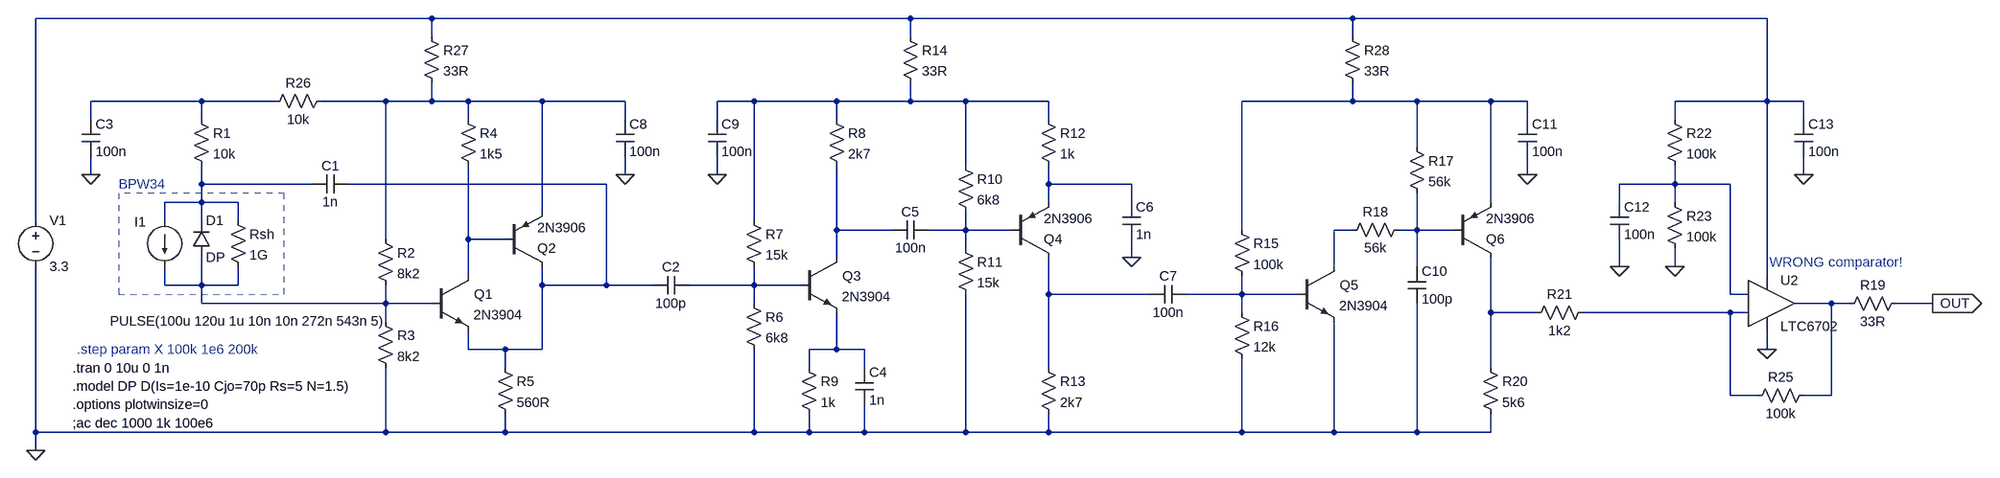
[diagram p0: schematic Lighthouse Sensor Alan Yates Twitter.asc]
Lighthouse Sensor Alan Yates Twitter.asc, the LTspice schematic file:
Version 4
SHEET 1 2772 700
WIRE 48 -112 -640 -112
WIRE 880 -112 48 -112
WIRE 1648 -112 880 -112
WIRE 2368 -112 1648 -112
WIRE 48 -80 48 -112
WIRE 880 -80 880 -112
WIRE 1648 -80 1648 -112
WIRE -352 32 -544 32
WIRE -224 32 -352 32
WIRE -32 32 -144 32
WIRE 48 32 48 0
WIRE 48 32 -32 32
WIRE 112 32 48 32
WIRE 240 32 112 32
WIRE 384 32 240 32
WIRE 608 32 544 32
WIRE 752 32 608 32
WIRE 880 32 880 0
WIRE 880 32 752 32
WIRE 976 32 880 32
WIRE 1120 32 976 32
WIRE 1648 32 1648 0
WIRE 1648 32 1456 32
WIRE 1760 32 1648 32
WIRE 1888 32 1760 32
WIRE 1952 32 1888 32
WIRE 2368 32 2368 -112
WIRE 2368 32 2208 32
WIRE 2432 32 2368 32
WIRE -544 64 -544 32
WIRE -352 64 -352 32
WIRE 112 64 112 32
WIRE 384 64 384 32
WIRE 544 64 544 32
WIRE 752 64 752 32
WIRE 1120 64 1120 32
WIRE 1952 64 1952 32
WIRE 2208 64 2208 32
WIRE 2432 64 2432 32
WIRE 1760 112 1760 32
WIRE 976 144 976 32
WIRE -544 160 -544 128
WIRE 384 160 384 128
WIRE 544 160 544 128
WIRE 1952 160 1952 128
WIRE 2432 160 2432 128
WIRE -352 176 -352 144
WIRE -160 176 -352 176
WIRE 352 176 -96 176
WIRE 1120 176 1120 144
WIRE 1264 176 1120 176
WIRE 2208 176 2208 144
WIRE 2208 176 2112 176
WIRE 2304 176 2208 176
WIRE -352 208 -352 176
WIRE -352 208 -416 208
WIRE -288 208 -352 208
WIRE 1120 208 1120 176
WIRE 1264 208 1264 176
WIRE 1888 208 1888 32
WIRE 2112 208 2112 176
WIRE 2208 208 2208 176
WIRE 240 224 240 32
WIRE -640 240 -640 -112
WIRE -416 240 -416 208
WIRE -352 240 -352 208
WIRE -288 240 -288 208
WIRE 608 240 608 32
WIRE 752 256 752 144
WIRE 848 256 752 256
WIRE 976 256 976 224
WIRE 976 256 912 256
WIRE 1056 256 976 256
WIRE 1456 256 1456 32
WIRE 1648 256 1616 256
WIRE 1760 256 1760 192
WIRE 1760 256 1728 256
WIRE 1824 256 1760 256
WIRE -32 272 -32 32
WIRE 112 272 112 144
WIRE 176 272 112 272
WIRE 976 288 976 256
WIRE 752 304 752 256
WIRE 1264 304 1264 272
WIRE 1616 320 1616 256
WIRE 1760 320 1760 256
WIRE 2112 320 2112 272
WIRE 2128 320 2112 320
WIRE 2208 320 2208 288
WIRE 112 336 112 272
WIRE 2368 336 2368 32
WIRE -416 352 -416 320
WIRE -352 352 -352 304
WIRE -352 352 -416 352
WIRE -288 352 -288 320
WIRE -288 352 -352 352
WIRE 240 352 240 320
WIRE 352 352 352 176
WIRE 352 352 240 352
WIRE 432 352 352 352
WIRE 608 352 608 320
WIRE 608 352 496 352
WIRE 688 352 608 352
WIRE 1120 368 1120 304
WIRE 1296 368 1120 368
WIRE 1456 368 1456 336
WIRE 1456 368 1360 368
WIRE 1552 368 1456 368
WIRE 2304 368 2304 176
WIRE 2336 368 2304 368
WIRE -352 384 -352 352
WIRE -32 384 -32 352
WIRE -32 384 -352 384
WIRE 48 384 -32 384
WIRE 608 384 608 352
WIRE 2480 384 2416 384
WIRE 2512 384 2480 384
WIRE 2656 384 2592 384
WIRE 1456 400 1456 368
WIRE 1888 400 1888 304
WIRE 1968 400 1888 400
WIRE 2304 400 2048 400
WIRE 2336 400 2304 400
WIRE -32 416 -32 384
WIRE 112 464 112 432
WIRE 176 464 112 464
WIRE 240 464 240 352
WIRE 240 464 176 464
WIRE 752 464 752 400
WIRE 752 464 704 464
WIRE 800 464 752 464
WIRE 2368 464 2368 432
WIRE 176 496 176 464
WIRE 704 496 704 464
WIRE 800 496 800 464
WIRE 1120 496 1120 368
WIRE 1888 496 1888 400
WIRE 2304 544 2304 400
WIRE 2352 544 2304 544
WIRE 2480 544 2480 384
WIRE 2480 544 2432 544
WIRE -640 608 -640 320
WIRE -32 608 -32 496
WIRE -32 608 -640 608
WIRE 176 608 176 576
WIRE 176 608 -32 608
WIRE 608 608 608 464
WIRE 608 608 176 608
WIRE 704 608 704 576
WIRE 704 608 608 608
WIRE 800 608 800 560
WIRE 800 608 704 608
WIRE 976 608 976 368
WIRE 976 608 800 608
WIRE 1120 608 1120 576
WIRE 1120 608 976 608
WIRE 1456 608 1456 480
WIRE 1456 608 1120 608
WIRE 1616 608 1616 416
WIRE 1616 608 1456 608
WIRE 1760 608 1760 384
WIRE 1760 608 1616 608
WIRE 1888 608 1888 576
WIRE 1888 608 1760 608
WIRE -640 640 -640 608
FLAG 2656 384 OUT
IOPIN 2656 384 Out
FLAG -544 160 0
FLAG -640 640 0
FLAG 384 160 0
FLAG 544 160 0
FLAG 1264 304 0
FLAG 1952 160 0
FLAG 2368 464 0
FLAG 2208 320 0
FLAG 2112 320 0
FLAG 2432 160 0
SYMBOL diode -368 304 M180
WINDOW 0 24 64 Left 2
WINDOW 3 24 0 Left 2
SYMATTR InstName D1
SYMATTR Value DP
SYMBOL current -416 240 R0
WINDOW 3 -95 175 Left 2
WINDOW 123 -52 30 Left 2
WINDOW 39 0 0 Left 2
WINDOW 0 -52 2 Left 2
SYMATTR Value PULSE(100u 120u 1u 10n 10n 272n 543n 5)
SYMATTR InstName I1
SYMBOL res -304 224 R0
SYMATTR InstName Rsh
SYMATTR Value 1G
SYMBOL voltage -640 224 R0
WINDOW 123 0 0 Left 2
WINDOW 39 0 0 Left 2
SYMATTR InstName V1
SYMATTR Value 3.3
SYMBOL res -368 48 R0
SYMATTR InstName R1
SYMATTR Value 10k
SYMBOL res -48 256 R0
SYMATTR InstName R2
SYMATTR Value 8k2
SYMBOL res -48 400 R0
SYMATTR InstName R3
SYMATTR Value 8k2
SYMBOL res 96 48 R0
SYMATTR InstName R4
SYMATTR Value 1k5
SYMBOL res 160 480 R0
SYMATTR InstName R5
SYMATTR Value 560R
SYMBOL npn 48 336 R0
WINDOW 0 74 32 Left 2
WINDOW 3 73 68 Left 2
SYMATTR InstName Q1
SYMATTR Value 2N3904
SYMBOL pnp 176 320 M180
SYMATTR InstName Q2
SYMATTR Value 2N3906
SYMBOL cap -96 160 R90
WINDOW 0 0 32 VBottom 2
WINDOW 3 32 32 VTop 2
SYMATTR InstName C1
SYMATTR Value 1n
SYMBOL cap 496 336 R90
WINDOW 0 0 32 VBottom 2
WINDOW 3 32 32 VTop 2
SYMATTR InstName C2
SYMATTR Value 100p
SYMBOL res 592 368 R0
SYMATTR InstName R6
SYMATTR Value 6k8
SYMBOL res 592 224 R0
SYMATTR InstName R7
SYMATTR Value 15k
SYMBOL cap -560 64 R0
SYMATTR InstName C3
SYMATTR Value 100n
SYMBOL npn 688 304 R0
WINDOW 0 74 32 Left 2
WINDOW 3 73 68 Left 2
SYMATTR InstName Q3
SYMATTR Value 2N3904
SYMBOL res 736 48 R0
SYMATTR InstName R8
SYMATTR Value 2k7
SYMBOL res 688 480 R0
SYMATTR InstName R9
SYMATTR Value 1k
SYMBOL cap 784 496 R0
SYMATTR InstName C4
SYMATTR Value 1n
SYMBOL cap 912 240 R90
WINDOW 0 0 32 VBottom 2
WINDOW 3 32 32 VTop 2
SYMATTR InstName C5
SYMATTR Value 100n
SYMBOL res 960 128 R0
SYMATTR InstName R10
SYMATTR Value 6k8
SYMBOL res 960 272 R0
SYMATTR InstName R11
SYMATTR Value 15k
SYMBOL pnp 1056 304 M180
SYMATTR InstName Q4
SYMATTR Value 2N3906
SYMBOL res 1104 48 R0
SYMATTR InstName R12
SYMATTR Value 1k
SYMBOL res 1104 480 R0
SYMATTR InstName R13
SYMATTR Value 2k7
SYMBOL cap 1248 208 R0
SYMATTR InstName C6
SYMATTR Value 1n
SYMBOL cap 1360 352 R90
WINDOW 0 0 32 VBottom 2
WINDOW 3 32 32 VTop 2
SYMATTR InstName C7
SYMATTR Value 100n
SYMBOL res 1440 240 R0
SYMATTR InstName R15
SYMATTR Value 100k
SYMBOL res 1440 384 R0
SYMATTR InstName R16
SYMATTR Value 12k
SYMBOL npn 1552 320 R0
WINDOW 0 74 32 Left 2
WINDOW 3 73 68 Left 2
SYMATTR InstName Q5
SYMATTR Value 2N3904
SYMBOL pnp 1824 304 M180
SYMATTR InstName Q6
SYMATTR Value 2N3906
SYMBOL res 1744 96 R0
SYMATTR InstName R17
SYMATTR Value 56k
SYMBOL res 1744 240 R90
WINDOW 0 0 56 VBottom 2
WINDOW 3 32 56 VTop 2
SYMATTR InstName R18
SYMATTR Value 56k
SYMBOL res 1872 480 R0
SYMATTR InstName R20
SYMATTR Value 5k6
SYMBOL res 2064 384 R90
WINDOW 0 0 56 VBottom 2
WINDOW 3 32 56 VTop 2
SYMATTR InstName R21
SYMATTR Value 1k2
SYMBOL res 2192 48 R0
SYMATTR InstName R22
SYMATTR Value 100k
SYMBOL res 2192 192 R0
SYMATTR InstName R23
SYMATTR Value 100k
SYMBOL res 2448 528 R90
WINDOW 0 0 56 VBottom 2
WINDOW 3 32 56 VTop 2
SYMATTR InstName R25
SYMATTR Value 100k
SYMBOL res -128 16 R90
WINDOW 0 0 56 VBottom 2
WINDOW 3 32 56 VTop 2
SYMATTR InstName R26
SYMATTR Value 10k
SYMBOL res 32 -96 R0
SYMATTR InstName R27
SYMATTR Value 33R
SYMBOL res 864 -96 R0
SYMATTR InstName R14
SYMATTR Value 33R
SYMBOL res 1632 -96 R0
SYMATTR InstName R28
SYMATTR Value 33R
SYMBOL cap 368 64 R0
SYMATTR InstName C8
SYMATTR Value 100n
SYMBOL cap 528 64 R0
SYMATTR InstName C9
SYMATTR Value 100n
SYMBOL cap 1744 320 R0
SYMATTR InstName C10
SYMATTR Value 100p
SYMBOL cap 1936 64 R0
SYMATTR InstName C11
SYMATTR Value 100n
SYMBOL cap 2096 208 R0
SYMATTR InstName C12
SYMATTR Value 100n
SYMBOL cap 2416 64 R0
SYMATTR InstName C13
SYMATTR Value 100n
SYMBOL res 2608 368 R90
WINDOW 0 0 56 VBottom 2
WINDOW 3 32 56 VTop 2
SYMATTR InstName R19
SYMATTR Value 33R
SYMBOL Comparators\\LTC6702 2368 384 R0
SYMATTR InstName U2
TEXT -576 560 Left 2 !.options plotwinsize=0
TEXT -576 528 Left 2 !.model DP D(Is=1e-10 Cjo=70p Rs=5 N=1.5)
TEXT -496 176 Left 2 ;BPW34
TEXT 2488 312 Center 2 ;WRONG comparator!
TEXT -576 496 Left 2 !.tran 0 10u 0 1n
TEXT -576 592 Left 2 !;ac dec 1000 1k 100e6
TEXT -568 464 Left 2 ;.step param X 100k 1e6 200k
RECTANGLE Normal -496 368 -208 192 2

The netlist it stands for:
* Lighthouse Sensor Alan Yates Twitter.asc
D1 N015 N006 DP
I1 N006 N015 PULSE(100u 120u 1u 10n 10n 272n 543n 5)
Rsh N006 N015 1G
V1 N001 0 3.3
R1 N002 N006 10k
R2 N003 N015 8k2
R3 N015 0 8k2
R4 N003 N014 1k5
R5 N007 0 560R
Q1 N014 N015 N007 0 2N3904
Q2 N007 N014 N003 0 2N3906
C1 N007 N006 1n
C2 N016 N007 100p
R6 N016 0 6k8
R7 N004 N016 15k
C3 N002 0 100n
Q3 N010 N016 N022 0 2N3904
R8 N004 N010 2k7
R9 N022 0 1k
C4 N022 0 1n
C5 N011 N010 100n
R10 N004 N011 6k8
R11 N011 0 15k
Q4 N017 N011 N008 0 2N3906
R12 N004 N008 1k
R13 N017 0 2k7
C6 N008 0 1n
C7 N018 N017 100n
R15 N005 N018 100k
R16 N018 0 12k
Q5 N012 N018 0 0 2N3904
Q6 N020 N013 N005 0 2N3906
R17 N005 N013 56k
R18 N013 N012 56k
R20 N020 0 5k6
R21 N021 N020 1k2
R22 N001 N009 100k
R23 N009 0 100k
R25 N019 N021 100k
R26 N003 N002 10k
R27 N001 N003 33R
R14 N001 N004 33R
R28 N001 N005 33R
C8 N003 0 100n
C9 N004 0 100n
C10 N013 0 100p
C11 N005 0 100n
C12 N009 0 100n
C13 N001 0 100n
R19 OUT N019 33R
XU2 N021 N009 N001 0 N019 LTC6702
.model D D
.lib standard.dio
.model NPN NPN
.model PNP PNP
.lib standard.bjt
.options plotwinsize=0
.model DP D(Is=1e-10 Cjo=70p Rs=5 N=1.5)
* BPW34
* WRONG comparator!
.tran 0 10u 0 1n
;ac dec 1000 1k 100e6
* .step param X 100k 1e6 200k
.lib LTC3.lib
.backanno
.end